# EasyEDA Pro project ProPrj_Lan_Relay_blog_2026-03-05_10-33-51_2026-03-13.epro, schematic Schematic2

## Sheets
1 P1: Board Name: lan-relay-03; Create Date: 2026-03-10; Page Name: P1; Project Name: Lan_Relay_blog_2026-03-05_10-33-51; Schematic Name: Schematic2; Update Date: 2026-03-10; Company: EasyEDA.com; Page Size: A4; Version: V1.0
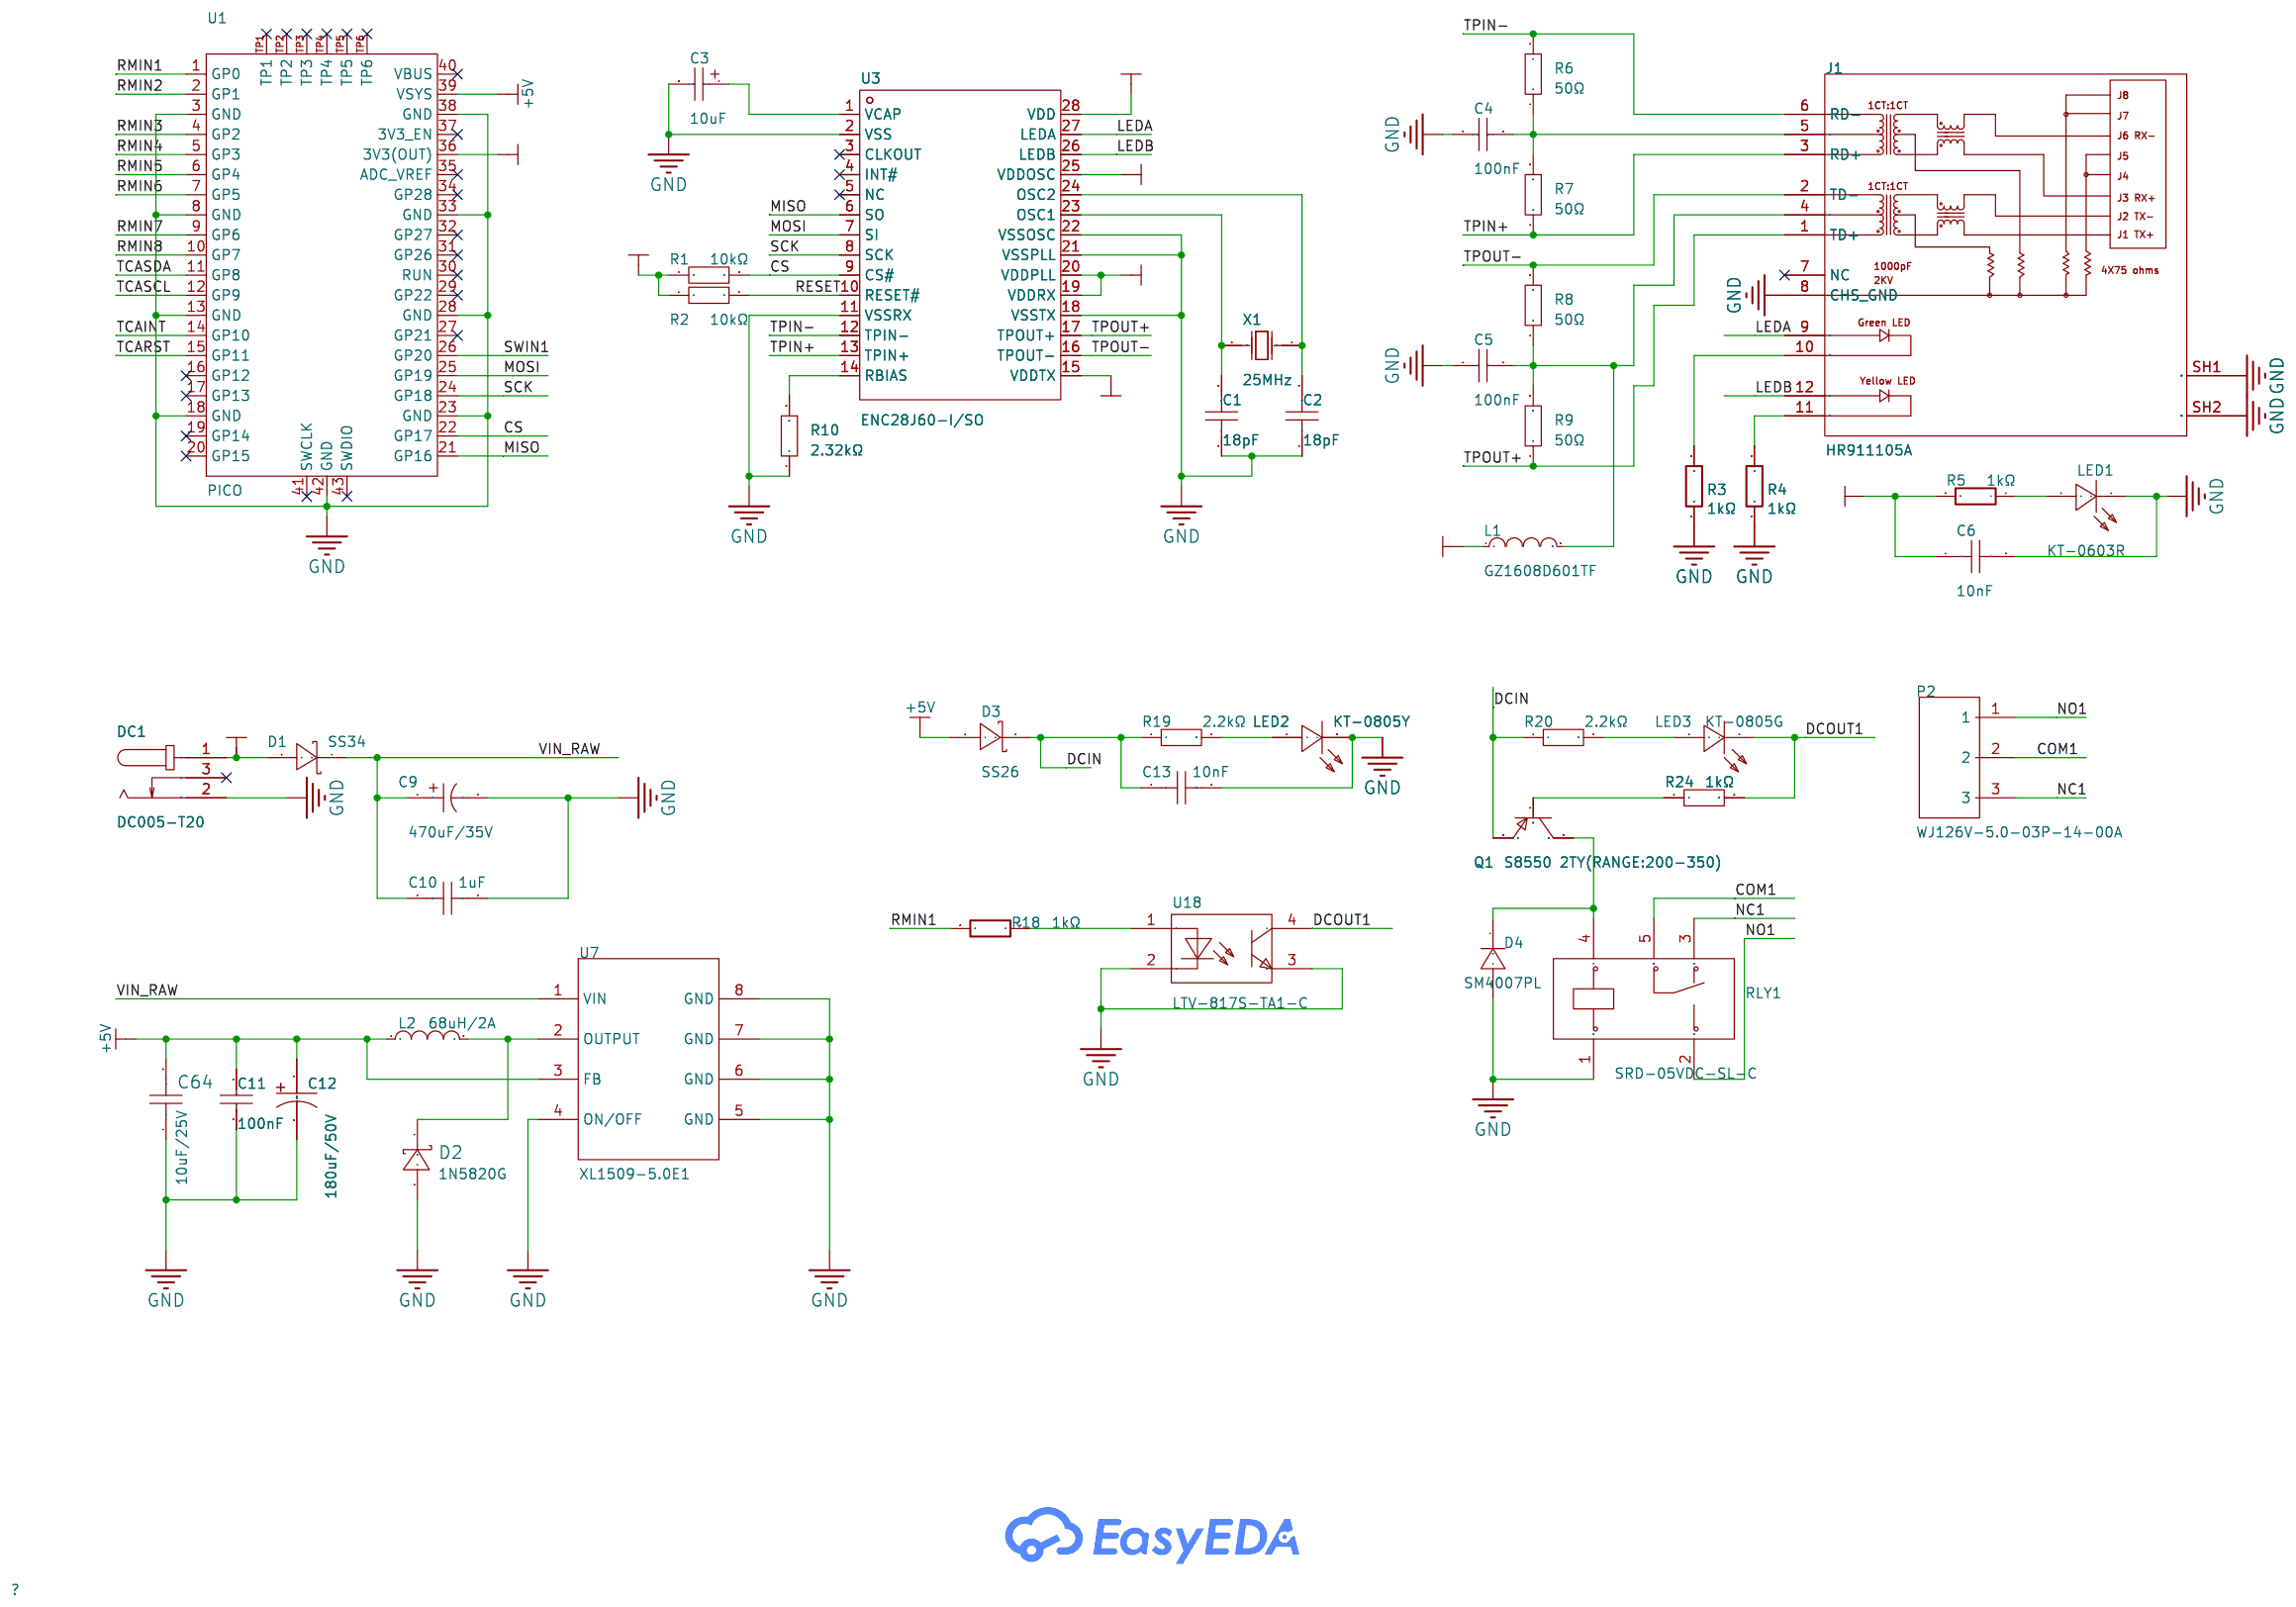
[diagram p1: P1]
2 P2: Page Name: P2
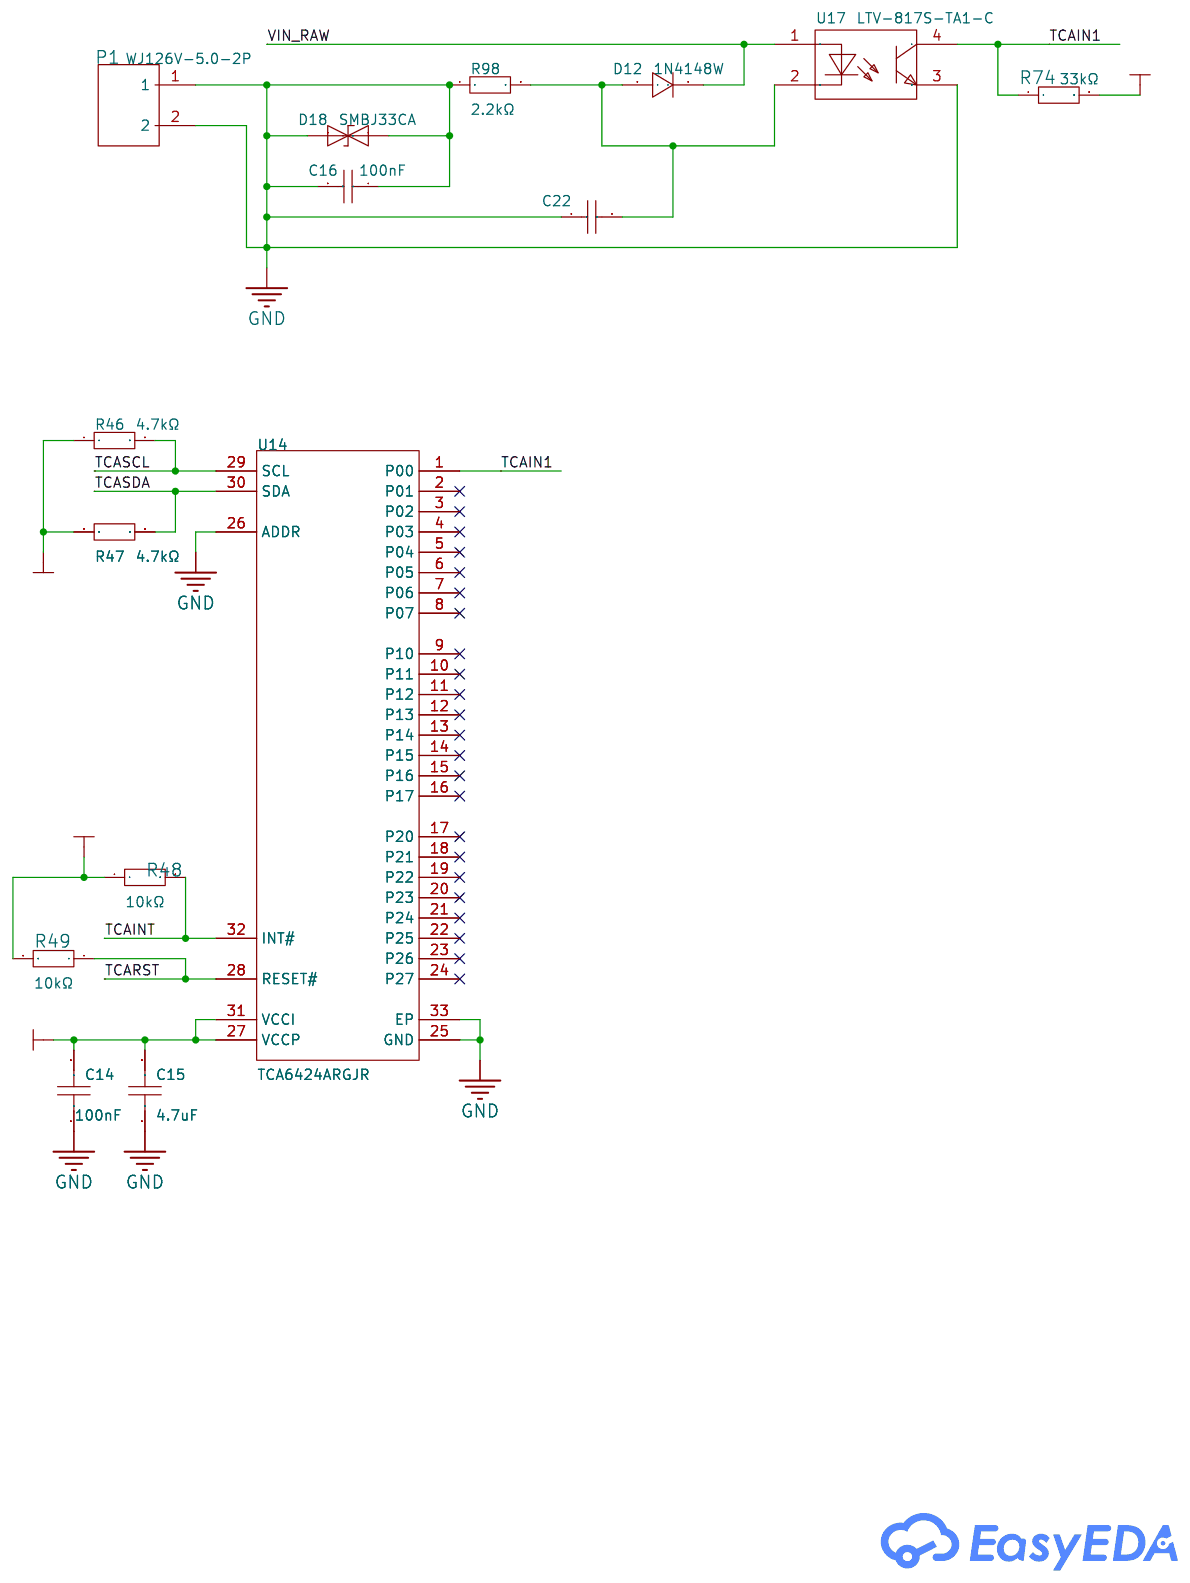
[diagram p2: P2]

## Parts
sheet P1
C1  18pF  [C0603]
C2  18pF  [C0603]
C3  10uF  [CAP-SMD_L3.2-W1.6-RD-C7171]
C4  100nF  [C0805]
C5  100nF  [C0805]
C6  10nF  [C0603]
C9  470uF  [CAP-TH_BD10.0-P5.00-D0.6-FD]
C10  1uF  [C0603]
C11  100nF  [C0805]
C12  180uF  [CAP-TH_BD8.0-P3.50-D0.6-FD]
C13  10nF  [C0603]
C64  10uF  [C0603]
D1  SS34  [SMA_L4.3-W2.6-LS5.2-RD]
D2  1N5820G  [DO-201AD_BD5.3-L8.4-P12.50-D1.4-RD]
D3  SS26  [SMA_L4.3-W2.6-LS5.2-RD]
D4  SM4007PL  [SOD-123F_L2.8-W1.8-LS3.7-RD]
DC1  DC005-T20  [DC-IN-TH_DC005-T20]
J1  HR911105A  [RJ45-TH_HR911105A]
L1  GZ1608D601TF  [L0603]
L2  68uH  [IND-SMD_L11.6-W10.1]
LED1  KT-0603R  [LED0603-RD]
LED2  KT-0805Y  [LED0805-R-RD]
LED3  KT-0805G  [LED0805-R-RD]
P2  WJ126V-5.0-03P-14-00A  [CONN-TH_3P-P5.00_WJ126V-5.0-3P]
Q1  S8550 2TY(RANGE:200-350)  [SOT-23-3_L2.9-W1.3-P1.90-LS2.4-BR]
R1  10kΩ  [R0603]
R2  10kΩ  [R0603]
R3  1kΩ  [R0603]
R4  1kΩ  [R0603]
R5  1kΩ  [R0603]
R6  50Ω  [R0603]
R7  50Ω  [R0603]
R8  50Ω  [R0603]
R9  50Ω  [R0603]
R10  2.32kΩ  [R0603]
R18  1kΩ  [R0603]
R19  2.2kΩ  [R0603]
R20  2.2kΩ  [R0603]
R24  1kΩ  [R0603]
RLY1  SRD-05VDC-SL-C  [RELAY-TH_SRD-XXVDC-XL-C]
U1  PICO  [RASPBERRY-PI-PICO THT/SMT]
U3  ENC28J60-I/SO  [SOIC-28_L17.9-W7.5-P1.27-LS10.3-BL]
U7  XL1509-5.0E1  [SOIC-8_L5.0-W4.0-P1.27-LS6.0-BL-1]
U18  LTV-817S-TA1-C  [OPTO-SMD-4_L4.6-W6.5-P2.54-LS10.3-BL]
X1  25MHz  [HC-49US_L11.5-W4.5-P4.88]
sheet P2
C14  100nF  [C0603]
C15  4.7uF  [C0603]
C16  100nF  [C0805]
C22  100nF  [C0805]
D12  1N4148W  [SOD-123F_L2.7-W1.6-LS3.8-RD]
D18  SMBJ33CA  [SMB_L4.3-W3.6-LS5.4-BI]
P1  WJ126V-5.0-2P  [CONN-TH_WJ126V-5.0-2P]
R46  4.7kΩ  [R0603]
R47  4.7kΩ  [R0603]
R48  10kΩ  [R0603]
R49  10kΩ  [R0603]
R74  33kΩ  [R0603]
R98  2.2kΩ  [R0603]
U14  TCA6424ARGJR  [VQFN-32_L5.0-W5.0-P0.50-TL-EP]
U17  LTV-817S-TA1-C  [OPTO-SMD-4_L4.6-W6.5-P2.54-LS10.3-BL]

## Library data of the parts
C1 C2 = CL10C180JB8NNNC: Capacitance:18pF Tolerance:±5% Tolerance:±5% Voltage Rating:50V Temperature Coefficient:C0G; LCSC Part Name: 18pF ±5% 50V; Supplier Part: C1647; Manufacturer: SAMSUNG(三星); Supplier Footprint: 0603; JLCPCB Part Class: Basic Part; Datasheet: https://item.szlcsc.com/datasheet/CL10C180JB8NNNC/1999.html; Supplier: LCSC; Tolerance: ±5%; Voltage Rating: 50V; Temperature Coefficient: C0G
C3 = TAJA106K016RNJ: Capacitance:10uF Tolerance:±10% Tolerance:±10% Voltage Rating:16V Equivalent Series Resistance(ESR):3Ω@100kHz Operating Temperature:-55℃~+125℃ Operating Temperature:-55℃~+125℃; LCSC Part Name: 10uF ±10% 16V; Supplier Part: C7171; Manufacturer: Kyocera AVX; Supplier Footprint: CASE-A-3216-18(mm); JLCPCB Part Class: Basic Part; Supplier: LCSC; Tolerance: ±10%; Voltage Rating: 16V; Equivalent Series Resistance(ESR): 3Ω@100kHz; Operating Temperature: -55℃~+125℃
C4 C5 C11 C16 C22 = CL21B104KCFNNNE: Capacitance:100nF Tolerance:±10% Tolerance:±10% Voltage Rating:100V Temperature Coefficient:X7R; LCSC Part Name: 100nF ±10% 100V; Supplier Part: C28233; Manufacturer: SAMSUNG(三星); Supplier Footprint: 0805; JLCPCB Part Class: Basic Part; Datasheet: https://item.szlcsc.com/datasheet/CL21B104KCFNNNE/28983.html; Supplier: LCSC; Tolerance: ±10%; Voltage Rating: 100V; Temperature Coefficient: X7R
C6 C13 = 0603B103K500NT: Capacitance:10nF Tolerance:±10% Tolerance:±10% Voltage Rating:50V Temperature Coefficient:X7R; LCSC Part Name: 10nF ±10% 50V; Supplier Part: C57112; Manufacturer: FH(风华); Supplier Footprint: 0603; JLCPCB Part Class: Basic Part; Datasheet: https://item.szlcsc.com/datasheet/0603B103K500NT/58143.html; Supplier: LCSC; Tolerance: ±10%; Voltage Rating: 50V; Temperature Coefficient: X7R
C9 = 01EC1266: Capacitance:470uF Tolerance:±20% Tolerance:±20% Voltage Rating:35V Ripple Current:1.4A@100kHz Equivalent Series Resistance(ESR):50mΩ@100kHz Pin Spacing:5mm Diameter:10mm Height - Seated (Max):16mm Lifetime:5000hrs@105℃ Operating Temperature:-40℃~+105℃ Ope; LCSC Part Name: 470uF ±20% 35V; Supplier Part: C2831772; Manufacturer: KNSCHA(科尼盛); Supplier Footprint: 插件,D10xL16mm; JLCPCB Part Class: Extended Part; Datasheet: https://item.szlcsc.com/datasheet/01EC1266/2987111.html; Supplier: LCSC; Tolerance: ±20%; Voltage Rating: 35V; Ripple Current: 1.4A@100kHz; Equivalent Series Resistance(ESR): 50mΩ@100kHz; Pin Spacing: 5mm; Diameter: 10mm; Height - Seated (Max): 16mm; Lifetime: 5000hrs@105℃; Operating Temperature: -40℃~+105℃
C10 = CL10A105KB8NNNC: Capacitance:1uF Tolerance:±10% Tolerance:±10% Voltage Rating:50V Temperature Coefficient:X5R; LCSC Part Name: 1uF ±10% 50V; Supplier Part: C15849; Manufacturer: SAMSUNG(三星); Supplier Footprint: 0603; JLCPCB Part Class: Basic Part; Datasheet: https://item.szlcsc.com/datasheet/CL10A105KB8NNNC/16531.html; Supplier: LCSC; Tolerance: ±10%; Voltage Rating: 50V; Temperature Coefficient: X5R
C12 = LKMD1401H181MF: Capacitance:180uF Tolerance:±20% Tolerance:±20% Voltage Rating:50V Ripple Current:1.19A@100kHz Equivalent Series Resistance(ESR):110mΩ@100kHz Pin Spacing:3.5mm Diameter:8mm Height - Seated (Max):14mm Lifetime:10000hrs@105℃; LCSC Part Name: 180uF ±20% 50V; Supplier Part: C443001; Manufacturer: Ymin(永铭); Supplier Footprint: 插件,D8xL14mm; JLCPCB Part Class: Extended Part; Supplier: LCSC; Tolerance: ±20%; Voltage Rating: 50V; Ripple Current: 1.19A@100kHz; Equivalent Series Resistance(ESR): 110mΩ@100kHz; Pin Spacing: 3.5mm; Diameter: 8mm; Height - Seated (Max): 14mm; Lifetime: 10000hrs@105℃
C64 = CL10A106MA8NRNC: Capacitance:10uF Tolerance:±20% Tolerance:±20% Voltage Rating:25V Temperature Coefficient:X5R; LCSC Part Name: 10uF ±20% 25V; Supplier Part: C96446; Manufacturer: SAMSUNG(三星); Supplier Footprint: 0603; JLCPCB Part Class: Basic Part; Datasheet: https://item.szlcsc.com/datasheet/CL10A106MA8NRNC/97651.html; Supplier: LCSC; Tolerance: ±20%; Voltage Rating: 25V; Temperature Coefficient: X5R
D1 = SS34_C8678: Diode Configuration:Independent Voltage - Forward(Vf@If):550mV@3A Voltage - DC Reverse(Vr):40V Current - Rectified:3A Reverse Leakage Current (Ir):500uA@40V Operating Junction Temperature Range:-55℃~+125℃ Operating Junction Temperature Range:-55℃~+125℃; LCSC Part Name: 电压:40V 电流:3A; Supplier Part: C8678; Manufacturer: MDD(辰达半导体); Supplier Footprint: SMA(DO-214AC); JLCPCB Part Class: Basic Part; Datasheet: https://item.szlcsc.com/datasheet/SS34/9178.html; Supplier: LCSC; Diode Configuration: Independent; Voltage - Forward(Vf@If): 550mV@3A; Voltage - DC Reverse(Vr): 40V; Current - Rectified: 3A; Reverse Leakage Current (Ir): 500uA@40V; Operating Junction Temperature Range: -55℃~+125℃
D2 = 1N5820G: Voltage - Forward(Vf@If):475mV@3A Voltage - DC Reverse(Vr):20V Current - Rectified:3A Reverse Leakage Current (Ir):2mA@20V Operating Junction Temperature Range:-65℃~+125℃ Operating Junction Temperature Range:-65℃~+125℃ Non-Repetitive Peak Forward Surge Cu; LCSC Part Name: 电压:20V 电流:3A; Supplier Part: C95400; Manufacturer: onsemi(安森美); Supplier Footprint: DO-201AD; JLCPCB Part Class: Extended Part; Datasheet: https://item.szlcsc.com/datasheet/1N5820G/96604.html; Supplier: LCSC; Voltage - Forward(Vf@If): 475mV@3A; Voltage - DC Reverse(Vr): 20V; Current - Rectified: 3A; Reverse Leakage Current (Ir): 2mA@20V; Operating Junction Temperature Range: -65℃~+125℃; Non-Repetitive Peak Forward Surge Current: 80A
D3 = SS26_C14238: Diode Configuration:Independent Voltage - Forward(Vf@If):700mV@2A Voltage - DC Reverse(Vr):60V Current - Rectified:2A Reverse Leakage Current (Ir):500uA@60V Operating Junction Temperature Range:-55℃~+150℃ Operating Junction Temperature Range:-55℃~+150℃; LCSC Part Name: 电压:60V 电流:2A; Supplier Part: C14238; Manufacturer: MDD(辰达半导体); Supplier Footprint: SMA(DO-214AC); JLCPCB Part Class: Extended Part; Datasheet: https://item.szlcsc.com/datasheet/SS26/14895.html; Supplier: LCSC; Diode Configuration: Independent; Voltage - Forward(Vf@If): 700mV@2A; Voltage - DC Reverse(Vr): 60V; Current - Rectified: 2A; Reverse Leakage Current (Ir): 500uA@60V; Operating Junction Temperature Range: -55℃~+150℃
D4 = SM4007PL_C64898: Diode Configuration:Independent Voltage - Forward(Vf@If):1.1V@1A Voltage - DC Reverse(Vr):1kV Current - Rectified:1A Reverse Leakage Current (Ir):10uA@1kV Non-Repetitive Peak Forward Surge Current:25A Operating Junction Temperature Range:-55℃~+150℃ Operat; LCSC Part Name: 1kV 1A; Supplier Part: C64898; Manufacturer: MDD(辰达半导体); Supplier Footprint: SOD-123FL; JLCPCB Part Class: Basic Part; Datasheet: https://item.szlcsc.com/datasheet/SM4007PL/65968.html; Supplier: LCSC; Diode Configuration: Independent; Voltage - Forward(Vf@If): 1.1V@1A; Voltage - DC Reverse(Vr): 1kV; Current - Rectified: 1A; Reverse Leakage Current (Ir): 10uA@1kV; Non-Repetitive Peak Forward Surge Current: 25A; Operating Junction Temperature Range: -55℃~+150℃
DC1 = DC005-T20: Connector Type:DC Power Jack Mounting Type:Right Angle Inside Contact Diameter:2mm Outside Contact Diameter:6.3mm Current Rating:3A Voltage Rating (Max):12V Operating Temperature:-10℃~+60℃ Operating Temperature:-10℃~+60℃; LCSC Part Name: DC电源插座 内径:2mm 外径:6.3mm; Supplier Part: C111567; Manufacturer: SOFNG(硕方); Supplier Footprint: 插件; JLCPCB Part Class: Extended Part; Datasheet: https://item.szlcsc.com/datasheet/DC005-T20/112794.html; Supplier: LCSC; Connector Type: DC Power Jack; Mounting Type: Right Angle; Inside Contact Diameter: 2mm; Outside Contact Diameter: 6.3mm; Current Rating: 3A; Voltage Rating (Max): 12V; Operating Temperature: -10℃~+60℃
J1 = HR911105A_C12074: Connector Type:RJ45 Jack Mounting Type:- Number of Ports:1 LED:With LED Shielding:- Ratings:- PoE:Non-PoE Supplementary Features:Filtered Contact Material:- Contact Plating:- Operating Temperature:- Operating Temperature:-; LCSC Part Name: 带LED; Supplier Part: C12074; Manufacturer: HANRUN(汉仁); Supplier Footprint: 插件; JLCPCB Part Class: Extended Part; Datasheet: https://item.szlcsc.com/datasheet/HR911105A/12651.html; Supplier: LCSC; Connector Type: RJ45 Jack; Number of Ports: 1; LED: With LED; PoE: Non-PoE; Supplementary Features: Filtered
L1 = GZ1608D601TF: Impedance @ Frequency:600Ω@100MHz Tolerance:±25% Tolerance:±25% DC Resistance(DCR):450mΩ Current Rating:200mA Number of Circuits:1 Operating Temperature:-55℃~+125℃ Operating Temperature:-55℃~+125℃; LCSC Part Name: 单路 0603磁珠 阻抗600Ω@100MHz; Supplier Part: C1002; Manufacturer: Sunlord(顺络); Supplier Footprint: 0603; JLCPCB Part Class: Basic Part; Datasheet: https://item.szlcsc.com/datasheet/GZ1608D601TF/1354.html; Supplier: LCSC; Impedance @ Frequency: 600Ω@100MHz; Tolerance: ±25%; DC Resistance(DCR): 450mΩ; Current Rating: 200mA; Number of Circuits: 1; Operating Temperature: -55℃~+125℃
L2 = CYA1040-68UH: Inductance: Tolerance:±20% Tolerance:±20% Current Rating:2A Current - Saturation (Isat): DC Resistance(DCR):; LCSC Part Name: 68uH ±20% 3.5A; Supplier Part: C6364682; Manufacturer: SHOU HAN(首韩); Supplier Footprint: SMD,11.6x10.1mm; JLCPCB Part Class: Extended Part; Datasheet: https://atta.szlcsc.com/upload/public/pdf/source/20230523/A88BB47FBB74C4A463119F28DDC9B43D.pdf; Supplier: LCSC; Tolerance: ±20%; Current Rating: 2A
LED1 = KT-0603R: Emitted Color:Red Power Dissipation:- Forward Current:- Dominant Wavelength:- Dominant Wavelength:- Peak Wavelength:- Diode Configuration:- Lens Color:- Color Temperature:- Color Temperature:- Viewing Angle:- Mounting Sytle:- Operating Temperature:-40℃~+8; LCSC Part Name: 0603 红灯 高亮; Supplier Part: C2286; Manufacturer: KENTO; Supplier Footprint: 0603; JLCPCB Part Class: Basic Part; Datasheet: https://atta.szlcsc.com/upload/public/pdf/source/20160616/1466072038404.pdf; Supplier: LCSC; Emitted Color: Red; Operating Temperature: -40℃~+85℃
LED2 = KT-0805Y: Illumination Color:Yellow Voltage - Forward(Vf):1.8V~2.4V Voltage - Forward(Vf):1.8V~2.4V Power(Watts):40mW Forward Current:- Wavelength - Dominant:584nm~594nm Wavelength - Dominant:584nm~594nm Peak Wavelength:596nm Diode Configuration:- Lens Color:Water; LCSC Part Name: 0805 黄灯 高亮; Supplier Part: C2296; Manufacturer: KENTO; Supplier Footprint: 0805; JLCPCB Part Class: Basic Part; Datasheet: https://item.szlcsc.com/datasheet/KT-0805Y/2669.html; Supplier: LCSC; Illumination Color: Yellow; Voltage - Forward(Vf): 1.8V~2.4V; Power(Watts): 40mW; Wavelength - Dominant: 584nm~594nm; Peak Wavelength: 596nm; Lens Color: Water Clear; Luminous Intensity: 175mcd; Viewing Angle: 120°; Operating Temperature: -40℃~+85℃
LED3 = KT-0805G: Lamp Holder Type:- Illumination Color:Emerald Green Voltage - Forward(Vf):2.6V~3.1V Voltage - Forward(Vf):2.6V~3.1V Power(Watts):100mW Forward Current:5mA Wavelength - Dominant:513nm~528nm Wavelength - Dominant:513nm~528nm Peak Wavelength:525nm Diode Conf; LCSC Part Name: 0805 翠绿 高亮; Supplier Part: C2297; Manufacturer: KENTO; Supplier Footprint: 0805; JLCPCB Part Class: Basic Part; Datasheet: https://item.szlcsc.com/datasheet/KT-0805G/2670.html; Supplier: LCSC; Illumination Color: Emerald Green; Voltage - Forward(Vf): 2.6V~3.1V; Power(Watts): 100mW; Forward Current: 5mA; Wavelength - Dominant: 513nm~528nm; Peak Wavelength: 525nm; Luminous Intensity: 430mcd; Viewing Angle: 120°; Operating Temperature: -40℃~+85℃
P2 = WJ126V-5.0-03P-14-00A: Number of Positions or Pins:1x3P Pitch:5mm Color:Green Mounting Type:Through Hole Number of Pins:3P Number of Rows:1 Number of PINs Per Row:3 Current Rating:18A Voltage Rating (Max):250V Wire Gauge - AWG:14~26 Wire Gauge - mm2:2.5 Wire Gauge - mm2:2.5 Ope; LCSC Part Name: 1x3P 5mm 直插 排数:1 每排P数:3; Supplier Part: C8401; Manufacturer: KANGNEX(康奈克斯电气); Supplier Footprint: 插件,P=5mm; JLCPCB Part Class: Extended Part; Datasheet: https://item.szlcsc.com/datasheet/WJ126V-5.0-03P-14-00A/8895.html; Supplier: LCSC; Number of Positions or Pins: 1x3P; Pitch: 5mm; Color: Green; Mounting Type: Through Hole; Number of Pins: 3P; Number of Rows: 1; Number of PINs Per Row: 3; Current Rating: 18A; Voltage Rating (Max): 250V; Wire Gauge - AWG: 14~26; Wire Gauge - mm2: 2.5; Operating Temperature: -40℃~+105℃
Q1 = S8550 2TY(RANGE:200-350): type:PNP Current - Collector(Ic):500mA Collector - Emitter Voltage VCEO: Pd - Power Dissipation:300mW DC Current Gain:120@50mA,1V DC Current Gain:120@50mA,1V Transition frequency(fT):150MHz Current - Collector Cutoff:100nA Vce Saturation(VCE(sat)):600mV O; LCSC Part Name: H档(200-350); Supplier Part: C2147; Manufacturer: CJ(江苏长电/长晶); Supplier Footprint: SOT-23; JLCPCB Part Class: Extended Part; Datasheet: https://atta.szlcsc.com/upload/public/pdf/source/20120512/1457706508743.pdf; Supplier: LCSC; type: PNP; Current - Collector(Ic): 500mA; Pd - Power Dissipation: 300mW; DC Current Gain: 120@50mA,1V; Transition frequency(fT): 150MHz; Current - Collector Cutoff: 100nA; Vce Saturation(VCE(sat)): 600mV; Operating Temperature: -55℃~+150℃
R1 R2 R48 R49 = 0603WAF1002T5E: Type:Thick Film Resistor Resistance:10kΩ Tolerance:±1% Tolerance:±1% Power(Watts):100mW Voltage-Supply(Max):75V Temperature Coefficient:±100ppm/℃ Temperature Coefficient:±100ppm/℃ Operating Temperature:-55℃~+155℃ Operating Temperature:-55℃~+155℃; LCSC Part Name: 厚膜电阻 10kΩ ±1% 100mW; Supplier Part: C25804; Manufacturer: UNI-ROYAL(厚声); Supplier Footprint: 0603; JLCPCB Part Class: Basic Part; Datasheet: https://item.szlcsc.com/datasheet/0603WAF1002T5E/26547.html; Supplier: LCSC; Type: Thick Film Resistor; Tolerance: ±1%; Power(Watts): 100mW; Voltage-Supply(Max): 75V; Temperature Coefficient: ±100ppm/℃; Operating Temperature: -55℃~+155℃
R3-R5 R18 R24 = 0603WAF1001T5E: Type:Thick Film Resistor Resistance:1kΩ Tolerance:±1% Tolerance:±1% Power(Watts):100mW Voltage-Supply(Max):75V Temperature Coefficient:±100ppm/℃ Temperature Coefficient:±100ppm/℃ Operating Temperature:-55℃~+155℃ Operating Temperature:-55℃~+155℃; LCSC Part Name: 1kΩ ±1% 100mW 厚膜电阻; Supplier Part: C21190; Manufacturer: UNI-ROYAL(厚声); Supplier Footprint: 0603; JLCPCB Part Class: Basic Part; Datasheet: https://item.szlcsc.com/datasheet/0603WAF1001T5E/21904.html; Supplier: LCSC; Type: Thick Film Resistor; Tolerance: ±1%; Power(Watts): 100mW; Voltage-Supply(Max): 75V; Temperature Coefficient: ±100ppm/℃; Operating Temperature: -55℃~+155℃
R6-R9 = CRCW060350R0FKEA: Type:Thick Film Resistors Resistance:50Ω Tolerance:±1% Tolerance:±1% Power(Watts):100mW Temperature Coefficient:±100ppm/℃ Temperature Coefficient:±100ppm/℃ Operating Temperature:-55℃~+155℃ Operating Temperature:-55℃~+155℃; LCSC Part Name: 厚膜电阻 50Ω ±1% 100mW; Supplier Part: C844932; Manufacturer: VISHAY(威世); Supplier Footprint: 0603; JLCPCB Part Class: Extended Part; Datasheet: https://item.szlcsc.com/datasheet/CRCW060350R0FKEA/904506.html; Supplier: LCSC; Type: Thick Film Resistors; Tolerance: ±1%; Power(Watts): 100mW; Temperature Coefficient: ±100ppm/℃; Operating Temperature: -55℃~+155℃
R10 = 0603WAF2321T5E: Type:Thick Film Resistor Resistance:2.32kΩ Tolerance:±1% Tolerance:±1% Power(Watts):100mW Voltage-Supply(Max):75V Temperature Coefficient:±100ppm/℃ Temperature Coefficient:±100ppm/℃ Operating Temperature:-55℃~+155℃ Operating Temperature:-55℃~+155℃; LCSC Part Name: 2.32kΩ ±1% 100mW 厚膜电阻; Supplier Part: C22905; Manufacturer: UNI-ROYAL(厚声); Supplier Footprint: 0603; JLCPCB Part Class: Extended Part; Datasheet: https://item.szlcsc.com/datasheet/0603WAF2321T5E/23632.html; Supplier: LCSC; Type: Thick Film Resistor; Tolerance: ±1%; Power(Watts): 100mW; Voltage-Supply(Max): 75V; Temperature Coefficient: ±100ppm/℃; Operating Temperature: -55℃~+155℃
R19 R20 R98 = 0603WAF2201T5E_C4190: Type:Thick Film Resistors Resistance:2.2kΩ Tolerance:±1% Tolerance:±1% Power(Watts): Overload Voltage (Max): Temperature Coefficient:±100ppm/℃ Temperature Coefficient:±100ppm/℃ Operating Temperature Range:-55℃~+155℃ Operating Temperature Range:-55℃~+155℃; LCSC Part Name: 2.2kΩ ±1% 100mW 厚膜电阻; Supplier Part: C4190; Manufacturer: UNI-ROYAL(厚声); Manufacturer Part: 0603WAF2201T5E; Supplier Footprint: 0603; JLCPCB Part Class: Basic Part; Datasheet: https://atta.szlcsc.com/upload/public/pdf/source/20200306/C422600_1E6D84923E4A46A82E41ADD87F860B5C.pdf; Supplier: LCSC; Type: Thick Film Resistors; Tolerance: ±1%; Temperature Coefficient: ±100ppm/℃; Operating Temperature Range: -55℃~+155℃
RLY1 = SRD-05VDC-SL-C: Coil Voltage:5V Contact Form:1 Form C: 1C (SPDT-CO) Number of Pins:5 Contact Rating:- Switching Voltage(Max):250V@AC Coil Rated Power:360mW Switching Current(Max):15A Coil Type:Non-Polarized - Single Coil Coil Resistance:70Ω Contact Resistance:100mΩ Opera; LCSC Part Name: 蓝色 单组转换型继电器; Supplier Part: C35449; Manufacturer: 松乐; Supplier Footprint: 插件,15.6x19.2mm; JLCPCB Part Class: Extended Part; Datasheet: https://item.szlcsc.com/datasheet/SRD-05VDC-SL-C/36422.html; Supplier: LCSC; Coil Voltage: 5V; Contact Form: 1 Form C: 1C (SPDT-CO); Number of Pins: 5; Switching Voltage(Max): 250V@AC; Coil Rated Power: 360mW; Switching Current(Max): 15A; Coil Type: Non-Polarized - Single Coil; Coil Resistance: 70Ω; Contact Resistance: 100mΩ; Operate Time: 10ms; Release Time: 10ms
U1 = PICO: Supplier Part: C7203002; Manufacturer: Raspberry Pi(树莓派); JLCPCB Part Class: Extended Part; Datasheet: https://item.szlcsc.com/datasheet/PICO/8170960.html; Supplier: LCSC
U3 = ENC28J60-I/SO: Number of Channels:1 Interface:SPI Voltage - Supply:3.3V Voltage - Supply:3.3V Current - Supply:160mA Operating Temperature:-40℃~+85℃ Operating Temperature:-40℃~+85℃; Supplier Part: C47351; Manufacturer: MICROCHIP(美国微芯); Supplier Footprint: SOIC-28-300mil; JLCPCB Part Class: Extended Part; Datasheet: https://item.szlcsc.com/datasheet/ENC28J60-I%252FSO/48356.html; Supplier: LCSC; Number of Channels: 1; Interface: SPI; Voltage - Supply: 3.3V; Current - Supply: 160mA; Operating Temperature: -40℃~+85℃
U7 = XL1509-5.0E1: Function:Buck Voltage - Supply:4.5V~40V Voltage - Supply:4.5V~40V Output Voltage:5V Output Voltage:5V Output Current:2A Frequency - Switching:150kHz Frequency - Switching:150kHz Operating Temperature:-40℃~+85℃ Operating Temperature:-40℃~+85℃ Synchronous R; LCSC Part Name: 2A 150KHz 40V 降压 DC-DC 转换器; Supplier Part: C61063; Manufacturer: XLSEMI(芯龙); Supplier Footprint: SOIC-8; JLCPCB Part Class: Basic Part; Datasheet: https://item.szlcsc.com/datasheet/XL1509-5.0E1/62115.html; Supplier: LCSC; Function: Buck; Voltage - Supply: 4.5V~40V; Output Voltage: 5V; Output Current: 2A; Frequency - Switching: 150kHz; Operating Temperature: -40℃~+85℃; Synchronous Rectifier: No; Number of Outputs: 1; Topology: Buck; Quiescent Current: 2mA; Switch tube (built-in/external): Built-in; Output Type: Fixed
U17 U18 = LTV-817S-TA1-C: Input type:DC Output Type:Phototransistor Voltage - Forward(Vf):1.2V Output Current:50mA Isolation Voltage(Vrms):5kV Reverse Voltage:6V Load Voltage:35V Number of Outputs:1 Vce Saturation(VCE(sat)):100mV@1mA,20mA Rise time:4us@2mA,100Ω Fall time:3us Opera; LCSC Part Name: DC输入 隔离电压(rms):5000V; Supplier Part: C109227; Manufacturer: LITEON(光宝); Supplier Footprint: SMD-4P; JLCPCB Part Class: Basic Part; Datasheet: https://item.szlcsc.com/datasheet/LTV-817S-TA1-C/110448.html; Supplier: LCSC; Input type: DC; Output Type: Phototransistor; Voltage - Forward(Vf): 1.2V; Output Current: 50mA; Isolation Voltage(Vrms): 5kV; Reverse Voltage: 6V; Load Voltage: 35V; Number of Outputs: 1; Vce Saturation(VCE(sat)): 100mV@1mA,20mA; Rise time: 4us@2mA,100Ω; Fall time: 3us; Operating Temperature: -30℃~+110℃; Current Transfer Ratio (CTR) Minimum: 50%; Current Transfer Ratio (CTR) Maximum/Saturation Value: 600%; Forward Current(If): 50mA
X1 = X49SD25MSD2SC: Type:Through-Hole Crystal Oscillator Frequency:25MHz Normal temperature Frequency Tolerance:±20ppm Normal temperature Frequency Tolerance:±20ppm Load Capacitance:20pF Frequency Stability:±30ppm Frequency Stability:±30ppm Operating Temperature:-20℃~+70℃ Op; LCSC Part Name: HC-49US 25MHZ 2P 49S 20PF ±20PPM -20~70℃ (±30PPM); Supplier Part: C14730; Manufacturer: YXC(扬兴晶振); Supplier Footprint: HC-49S; JLCPCB Part Class: Extended Part; Datasheet: https://item.szlcsc.com/datasheet/X49SD25MSD2SC/15400.html; Supplier: LCSC; Type: Through-Hole Crystal Oscillator; Normal temperature Frequency Tolerance: ±20ppm; Load Capacitance: 20pF; Frequency Stability: ±30ppm; Operating Temperature: -20℃~+70℃
C14 = CC0603KRX7R9BB104: Capacitance:100nF Tolerance:±10% Tolerance:±10% Voltage Rating:50V Temperature Coefficient:X7R; LCSC Part Name: 100nF ±10% 50V; Supplier Part: C14663; Manufacturer: YAGEO(国巨); Supplier Footprint: 0603; JLCPCB Part Class: Basic Part; Datasheet: https://item.szlcsc.com/datasheet/CC0603KRX7R9BB104/15331.html; Supplier: LCSC; Tolerance: ±10%; Voltage Rating: 50V; Temperature Coefficient: X7R
C15 = CL10A475KO8NNNC: Capacitance:4.7uF Tolerance:±10% Tolerance:±10% Voltage Rating:16V Temperature Coefficient:X5R; LCSC Part Name: 4.7uF ±10% 16V; Supplier Part: C19666; Manufacturer: SAMSUNG(三星); Supplier Footprint: 0603; JLCPCB Part Class: Basic Part; Datasheet: https://item.szlcsc.com/datasheet/CL10A475KO8NNNC/20375.html; Supplier: LCSC; Tolerance: ±10%; Voltage Rating: 16V; Temperature Coefficient: X5R
D12 = 1N4148W_C81598: Diode Configuration:Independent Voltage - Forward(Vf@If):1V@50mA Voltage - DC Reverse(Vr):75V Current - Rectified:150mA Pd - Power Dissipation:400mW Reverse Leakage Current (Ir):1uA@75V Reverse Recovery Time (trr):4ns Operating Junction Temperature Range:; Supplier Part: C81598; Manufacturer: ST(先科); Supplier Footprint: SOD-123; JLCPCB Part Class: Basic Part; Datasheet: https://item.szlcsc.com/datasheet/1N4148W/82750.html; Supplier: LCSC; Diode Configuration: Independent; Voltage - Forward(Vf@If): 1V@50mA; Voltage - DC Reverse(Vr): 75V; Current - Rectified: 150mA; Pd - Power Dissipation: 400mW; Reverse Leakage Current (Ir): 1uA@75V; Reverse Recovery Time (trr): 4ns; Non-Repetitive Peak Forward Surge Current: 1A
D18 = SMBJ33CA_C78420: Polarity:Bidirectional Reverse Stand-Off Voltage (Vrwm):33V Clamping Voltage:53.3V Peak Pulse Current (Ipp):11.3A Peak Pulse Power Dissipation (Ppp):600W@10/1000us Voltage - Breakdown:36.7V Reverse Leakage Current (Ir):1uA Operating Temperature:-65℃~+150℃; LCSC Part Name: 双向TVS 33V截止 峰值脉冲电流：11.3A; Supplier Part: C78420; Manufacturer: Brightking(君耀电子); Supplier Footprint: SMB(DO-214AA); JLCPCB Part Class: Extended Part; Datasheet: https://item.szlcsc.com/datasheet/SMBJ33CA/79555.html; Supplier: LCSC; Polarity: Bidirectional; Reverse Stand-Off Voltage (Vrwm): 33V; Clamping Voltage: 53.3V; Peak Pulse Current (Ipp): 11.3A; Peak Pulse Power Dissipation (Ppp): 600W@10/1000us; Voltage - Breakdown: 36.7V; Reverse Leakage Current (Ir): 1uA; Operating Temperature: -65℃~+150℃; Type: TVS
P1 = WJ126V-5.0-2P: Number of Positions or Pins:1x2P Pitch:5mm Color:Green Mounting Type:Through Hole Number of Pins:2P Number of Rows:1 Number of PINs Per Row:2 Current Rating:18A Voltage Rating (Max):250V Wire Gauge - AWG:14~26 Wire Gauge - AWG:14~26 Wire Gauge - mm2:2.5 W; LCSC Part Name: 5mm 1x2P 排数:1 每排P数:2 直插; Supplier Part: C8404; Manufacturer: KANGNEX(康奈克斯电气); Supplier Footprint: 插件,P=5mm; JLCPCB Part Class: Extended Part; Datasheet: https://item.szlcsc.com/datasheet/WJ126V-5.0-2P/8898.html; Supplier: LCSC; Number of Positions or Pins: 1x2P; Pitch: 5mm; Color: Green; Mounting Type: Through Hole; Number of Pins: 2P; Number of Rows: 1; Number of PINs Per Row: 2; Current Rating: 18A; Voltage Rating (Max): 250V; Wire Gauge - AWG: 14~26; Wire Gauge - mm2: 2.5; Operating Temperature: -40℃~+105℃
R46 R47 = 0603WAF4701T5E: Type:Thick Film Resistor Resistance:4.7kΩ Tolerance:±1% Tolerance:±1% Power(Watts):100mW Voltage-Supply(Max):75V Temperature Coefficient:±100ppm/℃ Temperature Coefficient:±100ppm/℃ Operating Temperature:-55℃~+155℃ Operating Temperature:-55℃~+155℃; LCSC Part Name: 4.7kΩ ±1% 100mW 厚膜电阻; Supplier Part: C23162; Manufacturer: UNI-ROYAL(厚声); Supplier Footprint: 0603; JLCPCB Part Class: Basic Part; Datasheet: https://item.szlcsc.com/datasheet/0603WAF4701T5E/23889.html; Supplier: LCSC; Type: Thick Film Resistor; Tolerance: ±1%; Power(Watts): 100mW; Voltage-Supply(Max): 75V; Temperature Coefficient: ±100ppm/℃; Operating Temperature: -55℃~+155℃
R74 = 0603WAF3302T5E: Type:Thick Film Resistor Resistance:33kΩ Tolerance:±1% Tolerance:±1% Power(Watts):100mW Voltage-Supply(Max):75V Temperature Coefficient:±100ppm/℃ Temperature Coefficient:±100ppm/℃ Operating Temperature:-55℃~+155℃ Operating Temperature:-55℃~+155℃; LCSC Part Name: 33kΩ ±1% 100mW 厚膜电阻; Supplier Part: C4216; Manufacturer: UNI-ROYAL(厚声); Supplier Footprint: 0603; JLCPCB Part Class: Basic Part; Datasheet: https://item.szlcsc.com/datasheet/0603WAF3302T5E/4623.html; Supplier: LCSC; Type: Thick Film Resistor; Tolerance: ±1%; Power(Watts): 100mW; Voltage-Supply(Max): 75V; Temperature Coefficient: ±100ppm/℃; Operating Temperature: -55℃~+155℃
U14 = TCA6424ARGJR: Interface:I2C；SMBus Number of I/O:24 Interrupt Output:With Interrupt Output Output Type:- Voltage - Supply:1.65V~5.5V Voltage - Supply:1.65V~5.5V Current - Output Low(IOL):- Current - Output High(IOH):- Clock Frequency:400kHz Operating Temperature:-40℃~+8; LCSC Part Name: TCA6424A 低电压24位I²C和SMBus I/O扩展器，带中断输出、复位和配置寄存器; Supplier Part: C80692; Manufacturer: TI(德州仪器); Supplier Footprint: VQFN-32-EP(5x5); JLCPCB Part Class: Extended Part; Datasheet: https://www.ti.com/cn/lit/gpn/tca6424a; Supplier: LCSC; Interface: I2C；SMBus; Number of I/O: 24; Interrupt Output: With Interrupt Output; Voltage - Supply: 1.65V~5.5V; Clock Frequency: 400kHz; Operating Temperature: -40℃~+85℃

## Nets
+3.3V: C6.1 C14.2 C15.2 L1.1 R1.1 R2.1 R5.2 R46.1 R47.1 R48.1 R49.2 R74.2 U1.36(3V3(OUT)) U3.15(VDDTX) U3.19(VDDRX) U3.20(VDDPLL) U3.25(VDDOSC) U3.28(VDD) U14.27(VCCP) U14.31(VCCI)
+5V: C11.1 C12.1 C64.2 D3.2(A) L2.1 U1.39(VSYS) U7.3(FB)
+12V: D1.2(A) DC1.1
GND: C1.1 C2.1 C3.2 C4.1 C5.1 C6.2 C9.2 C10.2 C11.2 C12.2 C13.2 C14.1 C15.1 C16.1 C16.2 C22.2 C64.1 D2.2(A) D4.2(A) D18.1 D18.2 DC1.2 J1.8(CHS GND) J1.SH1 J1.SH2 LED1.1(K) LED2.2(-) P1.1 P1.2 R3.1 R4.1 R10.1 R98.1 RLY1.1 U1.3(GND) U1.8(GND) U1.13(GND) U1.18(GND) U1.23(GND) U1.28(GND) U1.33(GND) U1.38(GND) U1.42(GND) U3.2(VSS) U3.11(VSSRX) U3.18(VSSTX) U3.21(VSSPLL) U3.22(VSSOSC) U7.4(ON/OFF) U7.5(GND) U7.6(GND) U7.7(GND) U7.8(GND) U14.25(GND) U14.26(ADDR) U14.33(EP) U17.3 U18.2 U18.3
VIN_RAW: C9.1 C10.1 D1.1(K) D12.1(K) U7.1(VIN) U17.1
COM1: P2.2 RLY1.5
CS: R1.2 U1.22(GP17) U3.9(CS#)
DCIN: C13.1 D3.1(K) Q1.2(E) R19.1 R20.1
DCOUT1: LED3.2(K) R24.2 U18.4
LEDA: J1.9 U3.27(LEDA)
LEDB: J1.12 U3.26(LEDB)
MISO: U1.21(GP16) U3.6(SO)
MOSI: U1.25(GP19) U3.7(SI)
NC1: P2.3 RLY1.3
NO1: P2.1 RLY1.2
RESET: R2.2 U3.10(RESET#)
RMIN1: R18.2 U1.1(GP0)
RMIN2: U1.2(GP1)
RMIN3: U1.4(GP2)
RMIN4: U1.5(GP3)
RMIN5: U1.6(GP4)
RMIN6: U1.7(GP5)
RMIN7: U1.9(GP6)
RMIN8: U1.10(GP7)
SCK: U1.24(GP18) U3.8(SCK)
SWIN1: U1.26(GP20)
TCAIN1: R74.1 U14.1(P00) U17.4
TCAINT: R48.2 U1.14(GP10) U14.32(INT#)
TCARST: R49.1 U1.15(GP11) U14.28(RESET#)
TCASCL: R46.2 U1.12(GP9) U14.29(SCL)
TCASDA: R47.2 U1.11(GP8) U14.30(SDA)
TPIN+: J1.3(RD+) R7.1 U3.13(TPIN+)
TPIN-: J1.6(RD-) R6.2 U3.12(TPIN-)
TPOUT+: J1.1(TD+) R9.1 U3.17(TPOUT+)
TPOUT-: J1.2(TD-) R8.2 U3.16(TPOUT-)
Net-(C1-2): C1.2 U3.23(OSC1) X1.2(OSC2)
Net-(C2-2): C2.2 U3.24(OSC2) X1.1(OSC1)
Net-(C3-1): C3.1 U3.1(VCAP)
Net-(C4-2): C4.2 J1.5 R6.1 R7.2
Net-(C5-2): C5.2 J1.4 L1.2 R8.1 R9.2
Net-(C22-1): C22.1 D12.2(A) R98.2 U17.2
Net-(D2-1): D2.1(C) L2.2 U7.2(OUTPUT)
Net-(D4-1): D4.1(C) Q1.3(C) RLY1.4
Net-(J1-10): J1.10 R3.2
Net-(J1-11): J1.11 R4.2
Net-(LED1-2): LED1.2(A) R5.1
Net-(LED2-1): LED2.1(+) R19.2
Net-(LED3-1): LED3.1(A) R20.2
Net-(Q1-1): Q1.1(B) R24.1
Net-(R10-2): R10.2 U3.14(RBIAS)
Net-(R18-1): R18.1 U18.1

Not connected (* = marked no-connect by the designer): DC1 3*; J1 7(NC)*; U1 16(GP12)* 17(GP13)* 19(GP14)* 20(GP15)* 27(GP21)* 29(GP22)* 30(RUN)* 31(GP26)* 32(GP27)* 34(GP28)* 35(ADC_VREF)* 37(3V3_EN)* 40(VBUS)* 41(SWCLK)* 43(SWDIO)* TP1* TP2* TP3* TP4* TP5* TP6*; U3 3(CLKOUT)* 4(INT#)* 5(NC)*; U14 2(P01)* 3(P02)* 4(P03)* 5(P04)* 6(P05)* 7(P06)* 8(P07)* 9(P10)* 10(P11)* 11(P12)* 12(P13)* 13(P14)* 14(P15)* 15(P16)* 16(P17)* 17(P20)* 18(P21)* 19(P22)* 20(P23)* 21(P24)* 22(P25)* 23(P26)* 24(P27)*
